# EAGLE design MAIN_MODULE (EAGLE 8.4.3)
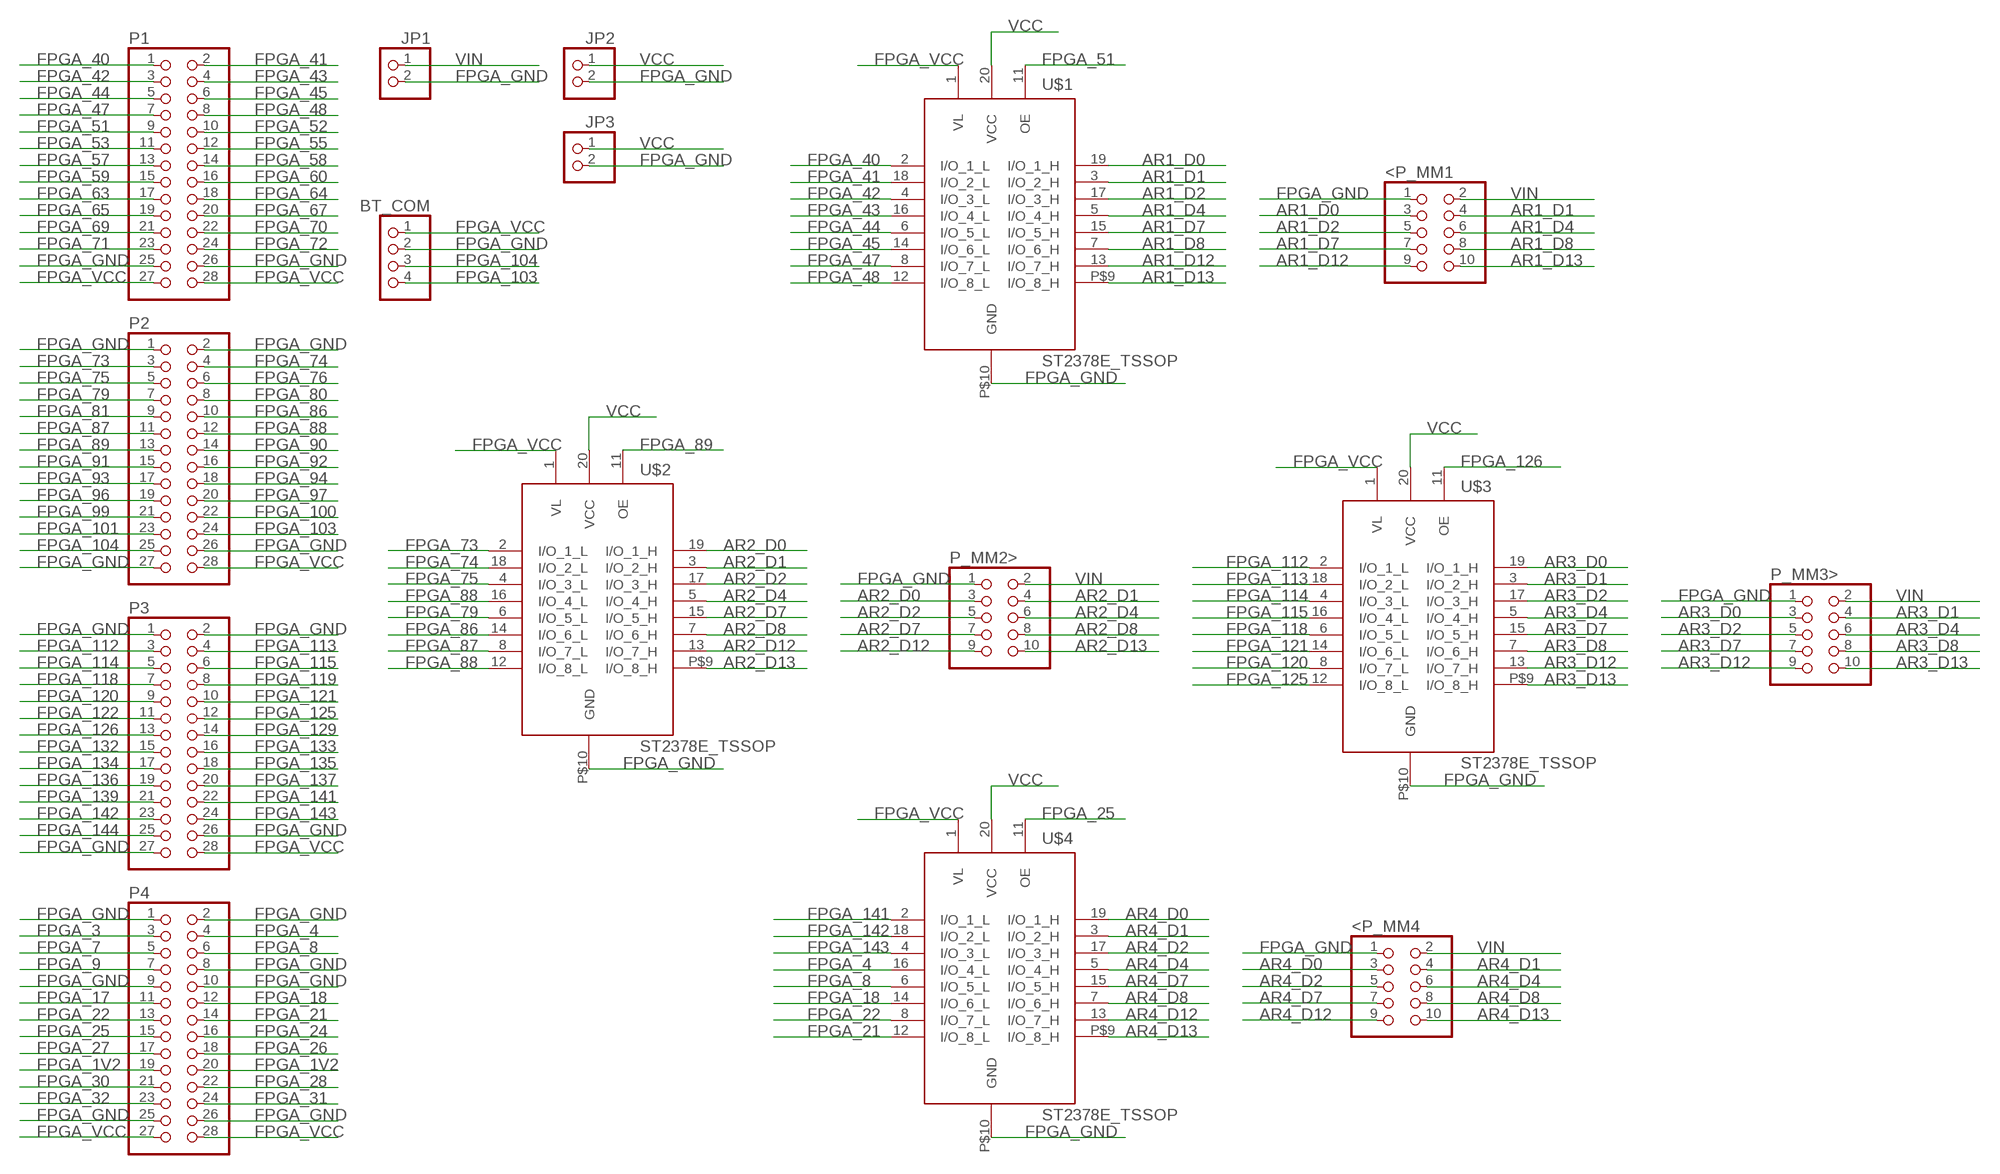
[diagram p0: schematic, sheet 1]

## Parts
<P_MM1  PINHD-2X5  [2X05]
<P_MM4  PINHD-2X5  [2X05]
BT_COM  PINHD-1X4  [1X04]
JP1  PINHD-1X2  [1X02]
JP2  PINHD-1X2  [1X02]
JP3  PINHD-1X2  [1X02]
P1  PINHD-2X14  [2X14]
P2  PINHD-2X14  [2X14]
P3  PINHD-2X14  [2X14]
P4  PINHD-2X14  [2X14]
P_MM2>  PINHD-2X5  [2X05]
P_MM3>  PINHD-2X5  [2X05]
U$1  ST2378E_TSSOP  [TSSOP20]
U$2  ST2378E_TSSOP  [TSSOP20]
U$3  ST2378E_TSSOP  [TSSOP20]
U$4  ST2378E_TSSOP  [TSSOP20]

## Nets
AR1_D0: <P_MM1.3 U$1.19(I/O_1_H)
AR1_D1: <P_MM1.4 U$1.3(I/O_2_H)
AR1_D2: <P_MM1.5 U$1.17(I/O_3_H)
AR1_D4: <P_MM1.6 U$1.5(I/O_4_H)
AR1_D7: <P_MM1.7 U$1.15(I/O_5_H)
AR1_D8: <P_MM1.8 U$1.7(I/O_6_H)
AR1_D12: <P_MM1.9 U$1.13(I/O_7_H)
AR1_D13: <P_MM1.10 U$1.P$9(I/O_8_H)
AR2_D0: P_MM2>.3 U$2.19(I/O_1_H)
AR2_D1: P_MM2>.4 U$2.3(I/O_2_H)
AR2_D2: P_MM2>.5 U$2.17(I/O_3_H)
AR2_D4: P_MM2>.6 U$2.5(I/O_4_H)
AR2_D7: P_MM2>.7 U$2.15(I/O_5_H)
AR2_D8: P_MM2>.8 U$2.7(I/O_6_H)
AR2_D12: P_MM2>.9 U$2.13(I/O_7_H)
AR2_D13: P_MM2>.10 U$2.P$9(I/O_8_H)
AR3_D0: P_MM3>.3 U$3.19(I/O_1_H)
AR3_D1: P_MM3>.4 U$3.3(I/O_2_H)
AR3_D2: P_MM3>.5 U$3.17(I/O_3_H)
AR3_D4: P_MM3>.6 U$3.5(I/O_4_H)
AR3_D7: P_MM3>.7 U$3.15(I/O_5_H)
AR3_D8: P_MM3>.8 U$3.7(I/O_6_H)
AR3_D12: P_MM3>.9 U$3.13(I/O_7_H)
AR3_D13: P_MM3>.10 U$3.P$9(I/O_8_H)
AR4_D0: <P_MM4.3 U$4.19(I/O_1_H)
AR4_D1: <P_MM4.4 U$4.3(I/O_2_H)
AR4_D2: <P_MM4.5 U$4.17(I/O_3_H)
AR4_D4: <P_MM4.6 U$4.5(I/O_4_H)
AR4_D7: <P_MM4.7 U$4.15(I/O_5_H)
AR4_D8: <P_MM4.8 U$4.7(I/O_6_H)
AR4_D12: <P_MM4.9 U$4.13(I/O_7_H)
AR4_D13: <P_MM4.10 U$4.P$9(I/O_8_H)
FPGA_1V2: P4.19 P4.20
FPGA_3: P4.3
FPGA_4: P4.4 U$4.16(I/O_4_L)
FPGA_7: P4.5
FPGA_8: P4.6 U$4.6(I/O_5_L)
FPGA_9: P4.7
FPGA_17: P4.11
FPGA_18: P4.12 U$4.14(I/O_6_L)
FPGA_21: P4.14 U$4.12(I/O_8_L)
FPGA_22: P4.13 U$4.8(I/O_7_L)
FPGA_24: P4.16
FPGA_25: P4.15 U$4.11(OE)
FPGA_26: P4.18
FPGA_27: P4.17
FPGA_28: P4.22
FPGA_30: P4.21
FPGA_31: P4.24
FPGA_32: P4.23
FPGA_40: P1.1 U$1.2(I/O_1_L)
FPGA_41: P1.2 U$1.18(I/O_2_L)
FPGA_42: P1.3 U$1.4(I/O_3_L)
FPGA_43: P1.4 U$1.16(I/O_4_L)
FPGA_44: P1.5 U$1.6(I/O_5_L)
FPGA_45: P1.6 U$1.14(I/O_6_L)
FPGA_47: P1.7 U$1.8(I/O_7_L)
FPGA_48: P1.8 U$1.12(I/O_8_L)
FPGA_51: P1.9 U$1.11(OE)
FPGA_52: P1.10
FPGA_53: P1.11
FPGA_55: P1.12
FPGA_57: P1.13
FPGA_58: P1.14
FPGA_59: P1.15
FPGA_60: P1.16
FPGA_63: P1.17
FPGA_64: P1.18
FPGA_65: P1.19
FPGA_67: P1.20
FPGA_69: P1.21
FPGA_70: P1.22
FPGA_71: P1.23
FPGA_72: P1.24
FPGA_73: P2.3 U$2.2(I/O_1_L)
FPGA_74: P2.4 U$2.18(I/O_2_L)
FPGA_75: P2.5 U$2.4(I/O_3_L)
FPGA_76: P2.6
FPGA_79: P2.7 U$2.6(I/O_5_L)
FPGA_80: P2.8
FPGA_81: P2.9
FPGA_86: P2.10 U$2.14(I/O_6_L)
FPGA_87: P2.11 U$2.8(I/O_7_L)
FPGA_88: P2.12 U$2.12(I/O_8_L) U$2.16(I/O_4_L)
FPGA_89: P2.13 U$2.11(OE)
FPGA_90: P2.14
FPGA_91: P2.15
FPGA_92: P2.16
FPGA_93: P2.17
FPGA_94: P2.18
FPGA_96: P2.19
FPGA_97: P2.20
FPGA_99: P2.21
FPGA_100: P2.22
FPGA_101: P2.23
FPGA_103: BT_COM.4 P2.24
FPGA_104: BT_COM.3 P2.25
FPGA_112: P3.3 U$3.2(I/O_1_L)
FPGA_113: P3.4 U$3.18(I/O_2_L)
FPGA_114: P3.5 U$3.4(I/O_3_L)
FPGA_115: P3.6 U$3.16(I/O_4_L)
FPGA_118: P3.7 U$3.6(I/O_5_L)
FPGA_119: P3.8
FPGA_120: P3.9 U$3.8(I/O_7_L)
FPGA_121: P3.10 U$3.14(I/O_6_L)
FPGA_122: P3.11
FPGA_125: P3.12 U$3.12(I/O_8_L)
FPGA_126: P3.13 U$3.11(OE)
FPGA_129: P3.14
FPGA_132: P3.15
FPGA_133: P3.16
FPGA_134: P3.17
FPGA_135: P3.18
FPGA_136: P3.19
FPGA_137: P3.20
FPGA_139: P3.21
FPGA_141: P3.22 U$4.2(I/O_1_L)
FPGA_142: P3.23 U$4.18(I/O_2_L)
FPGA_143: P3.24 U$4.4(I/O_3_L)
FPGA_144: P3.25
FPGA_GND: <P_MM1.1 <P_MM4.1 BT_COM.2 JP1.2 JP2.2 JP3.2 P1.25 P1.26 P2.1 P2.2 P2.26 P2.27 P3.1 P3.2 P3.26 P3.27 P4.1 P4.2 P4.8 P4.9 P4.10 P4.25 P4.26 P_MM2>.1 P_MM3>.1 U$1.P$10(GND) U$2.P$10(GND) U$3.P$10(GND) U$4.P$10(GND)
FPGA_VCC: BT_COM.1 P1.27 P1.28 P2.28 P3.28 P4.27 P4.28 U$1.1(VL) U$2.1(VL) U$3.1(VL) U$4.1(VL)
VCC: JP2.1 JP3.1 U$1.20(VCC) U$2.20(VCC) U$3.20(VCC) U$4.20(VCC)
VIN: <P_MM1.2 <P_MM4.2 JP1.1 P_MM2>.2 P_MM3>.2

## Library data of the parts
<P_MM1 <P_MM4 P_MM2> P_MM3> = pinhead:PINHD-2X5: PIN HEADER
BT_COM = pinhead:PINHD-1X4: PIN HEADER
JP1-JP3 = pinhead:PINHD-1X2: PIN HEADER
P1-P4 = pinhead:PINHD-2X14: PIN HEADER
U$1-U$4 = ST2378E:ST2378E_TSSOP

## Board
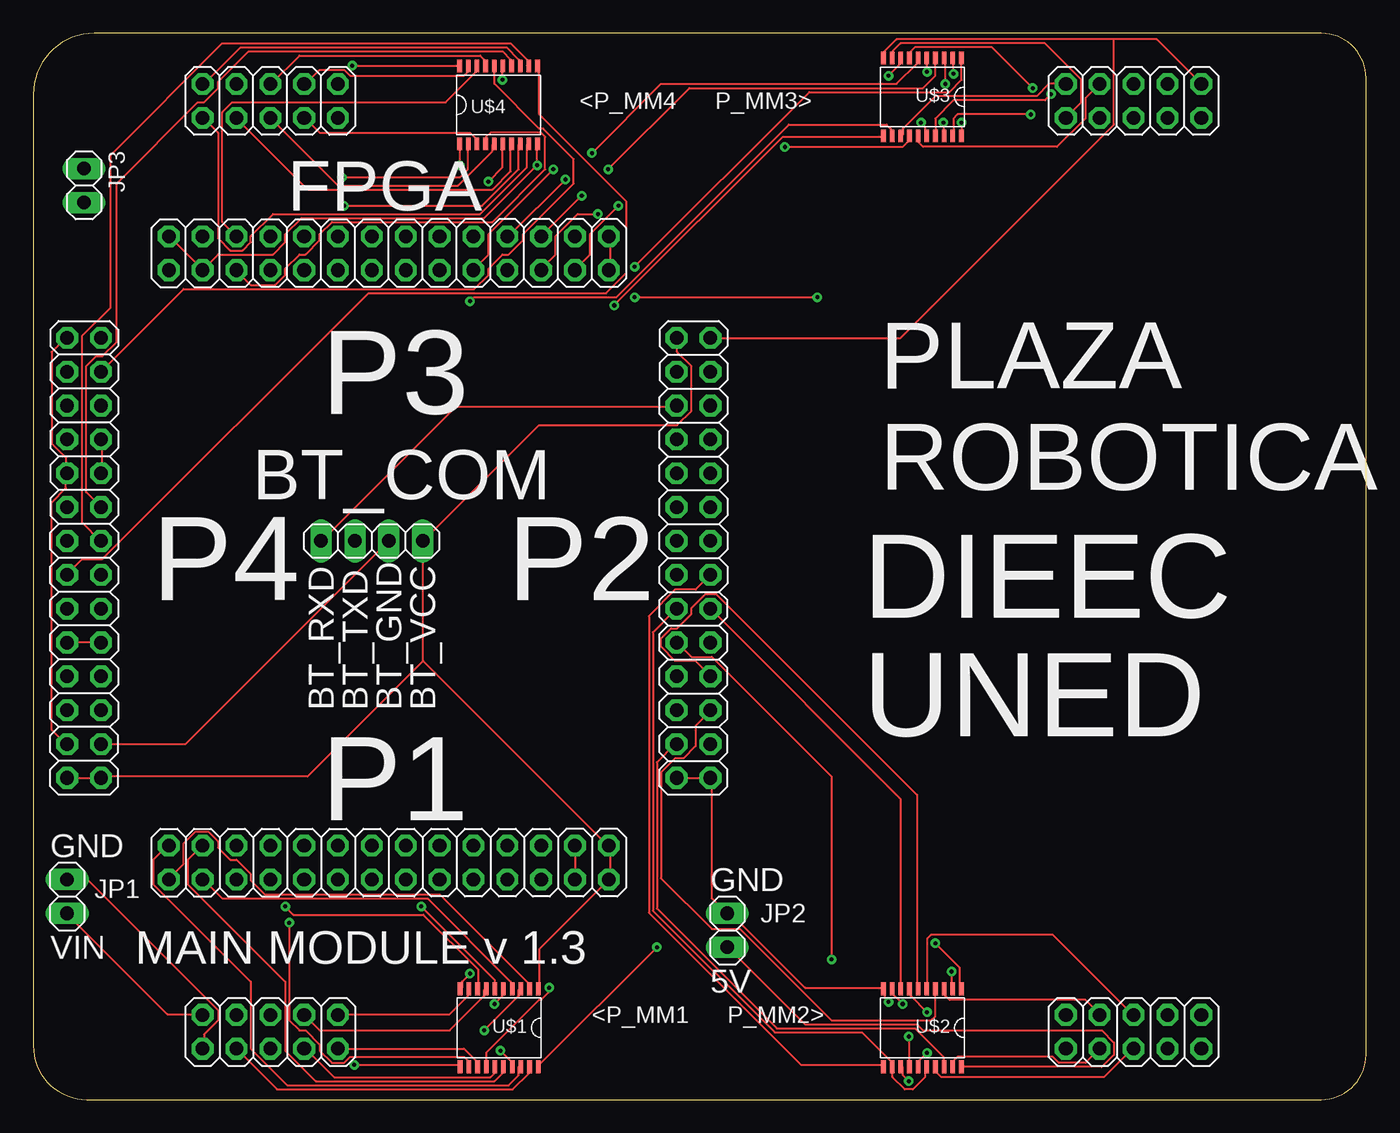
[diagram p1: board, top side]
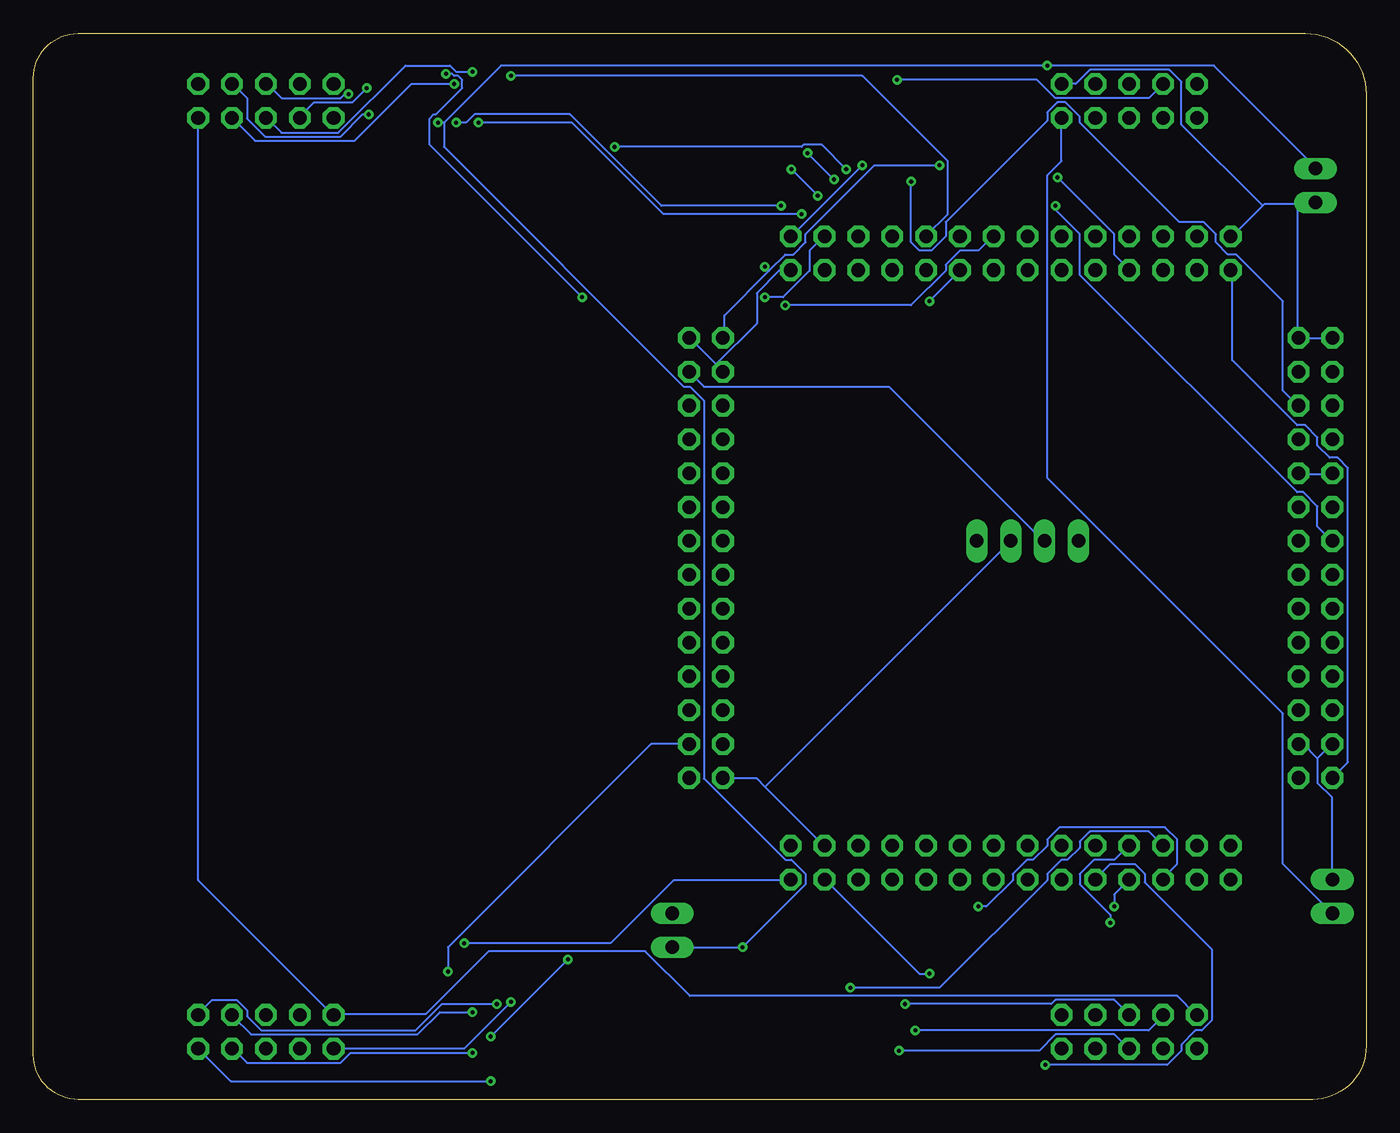
[diagram p2: board, bottom side, seen from below]

Size 100 x 80 mm. Coordinates in mm from the lower left corner, seen from the top.
Outline: 100,3.37 100,76.64 arc90 96.64,80 4.57,80 arc90 0,75.43 0,4.02 arc90 4.02,0 96.63,0 arc90 100,3.37
Copper layers (1*16): Top 0.035mm / dielectric 1.5mm / Bottom 0.035mm
Design rules "DFRobot_Eagle_Rule_v0.4": minimum track width 6mil, minimum drill 12mil, track to track 6mil, track to pad 6mil, pad to pad 6mil, via to via 6mil, smd to smd 0mil, copper to edge 10mil, drill to drill 10mil, minimum pad ring 12mil, minimum via ring 8mil, stop-mask expansion 2mil, vias tented up to drill 25mil, thermal gap 10mil

### Footprints (pad centres in the part's own frame; a part is rotated, then mirrored left to right if it is on the bottom)
2X05 = drill 1.016 octagon: 1 -5.08,-1.27; 2 -5.08,1.27; 3 -2.54,-1.27; 4 -2.54,1.27; 5 0,-1.27; 6 0,1.27; 7 2.54,-1.27; 8 2.54,1.27; 9 5.08,-1.27; 10 5.08,1.27
1X04 = drill 1.016 long: 1 -3.81,0; 2 -1.27,0; 3 1.27,0; 4 3.81,0
1X02 = drill 1.016 long: 1 -1.27,0; 2 1.27,0
2X14 = drill 1.016 octagon: 1 -16.51,-1.27; 2 -16.51,1.27; 3 -13.97,-1.27; 4 -13.97,1.27; 5 -11.43,-1.27; 6 -11.43,1.27; 7 -8.89,-1.27; 8 -8.89,1.27; 9 -6.35,-1.27; 10 -6.35,1.27; 11 -3.81,-1.27; 12 -3.81,1.27; 13 -1.27,-1.27; 14 -1.27,1.27; 15 1.27,-1.27; 16 1.27,1.27; 17 3.81,-1.27; 18 3.81,1.27; 19 6.35,-1.27; 20 6.35,1.27; 21 8.89,-1.27; 22 8.89,1.27; 23 11.43,-1.27; 24 11.43,1.27; 25 13.97,-1.27; 26 13.97,1.27; 27 16.51,-1.27; 28 16.51,1.27
TSSOP20 = smd 0.35 x 0.95: 1 -3.585,-3.225; 2 -2.935,-3.225; 3 -2.285,-3.225; 4 -1.635,-3.225; 5 -0.985,-3.225; 6 -0.335,-3.225; 7 0.315,-3.225; 8 0.965,-3.225; 11 2.265,2.625; 12 1.615,2.625; 13 0.965,2.625; 14 0.315,2.625; 15 -0.335,2.625; 16 -0.985,2.625; 17 -1.635,2.625; 18 -2.285,2.625; 19 -2.935,2.625; 20 -3.585,2.625; P$9 1.615,-3.225; P$10 2.265,-3.225

### Placement (x,y rotation side)
<P_MM1  17.78,5.08 0 top
<P_MM4  17.78,74.93 180 top
BT_COM  25.4,41.91 180 top
JP1  2.54,15.24 90 top
JP2  52.07,12.7 90 top
JP3  3.81,68.58 270 top
P1  26.67,17.78 0 top
P2  49.53,40.64 90 top
P3  26.67,63.5 180 top
P4  3.81,40.64 270 top
P_MM2>  82.55,5.08 0 top
P_MM3>  82.55,74.93 180 top
U$1  34.29,5.08 180 top
U$2  66.04,5.08 180 top
U$3  66.04,74.93 180 top
U$4  35.56,74.93 0 top

### Tracks (layer width: path | path; a pad name or v marks a point on that pad's centre or on a via)
AR1_D0
  Top 0.152: <P_MM1.3 18.29,0.76 35.97,0.76 37.19,1.98 37.19,2.44 U$1.19
AR1_D1  (via drill 0.3)
  Top 0.152: v33.83,5.18 36.42,7.77 36.42,8.23 U$1.3
  Bottom 0.152: v33.83,5.18 16.31,5.18 15.24,6.25 <P_MM1.4
AR1_D2  (via drill 0.3)
  Top 0.152: v35.05,3.66 35.81,2.9 35.81,2.59 U$1.17
  Bottom 0.152: v35.05,3.66 24.54,3.66 23.32,4.88 18.9,4.88 17.83,3.81 <P_MM1.5
AR1_D4  (via drill 0.3)
  Top 0.152: v34.59,7.16 35.2,7.77 35.2,8.23 U$1.5
  Bottom 0.152: v34.59,7.16 23.62,7.16 23.32,7.47 18.9,7.47 <P_MM1.6
AR1_D7
  Top 0.152: U$1.15 34.59,2.44 34.59,1.98 34.29,1.68 22.55,1.68 20.42,3.81 <P_MM1.7
AR1_D8
  Top 0.152: <P_MM1.8 21.49,5.18 31.24,5.18 33.83,7.77 33.83,8.23 U$1.7
AR1_D12
  Top 0.152: <P_MM1.9 32.31,3.81 33.22,2.9 33.22,2.59 U$1.13
AR1_D13
  Top 0.152: U$1.P$9 32.61,8.23 32.61,7.77 31.24,6.4 22.86,6.4 <P_MM1.10
AR2_D0
  Top 0.152: P_MM2>.3 78.94,2.74 76.96,2.74 76.5,3.2 69.34,3.2 69.04,2.9 69.04,2.59 U$2.19
AR2_D1
  Top 0.152: U$2.3 68.43,8.23 68.43,7.77 68.73,7.47 78.94,7.47 80.01,6.4 P_MM2>.4
AR2_D2
  Top 0.152: U$2.17 67.82,2.44 67.82,1.98 68.12,1.68 80.31,1.68 82.45,3.81 P_MM2>.5
AR2_D4
  Top 0.152: U$2.5 67.06,8.38 67.06,12.04 67.36,12.34 76.5,12.34 82.45,6.4 P_MM2>.6
AR2_D7  (via drill 0.3)
  Top 0.152: v67.06,3.5 66.45,2.9 66.45,2.59 U$2.15
  Bottom 0.152: v67.06,3.5 76.2,3.5 76.96,2.74 83.97,2.74 85.04,3.81 P_MM2>.7
AR2_D8  (via drill 0.3)
  Top 0.152: v67.06,6.55 65.84,7.77 65.84,8.23 U$2.7
  Bottom 0.152: v67.06,6.55 69.49,6.55 71.17,4.88 83.67,4.88 85.04,6.25 P_MM2>.8
AR2_D12  (via drill 0.3)
  Top 0.152: v65.68,1.37 65.23,1.83 65.23,2.44 U$2.13
  Bottom 0.152: v65.68,1.37 85.19,1.37 P_MM2>.9
AR2_D13  (via drill 0.3)
  Top 0.152: v65.23,7.16 64.47,7.92 64.47,8.23 U$2.P$9
  Bottom 0.152: v65.23,7.16 69.34,7.16 71.32,5.18 82.91,5.18 83.97,6.25 83.97,6.71 84.73,7.47 86.56,7.47 87.63,6.4 P_MM2>.10
AR3_D0  (via drill 0.3)
  Top 0.152: v74.83,73.91 69.34,73.91 69.04,73.61 69.04,72.39 U$3.19
  Bottom 0.152: v74.83,73.91 75.29,73.91 76.96,72.24 82.6,72.24 83.97,73.61 83.97,75.13 85.04,76.2 P_MM3>.3
AR3_D1  (via drill 0.3)
  Top 0.152: v68.43,76.2 68.43,78.03 U$3.3
  Bottom 0.152: v68.43,76.2 71.63,76.2 75.89,71.93 83.36,71.93 P_MM3>.4
AR3_D2  (via drill 0.3)
  Top 0.152: v76.35,75.44 75.89,74.98 69.04,74.98 67.67,73.61 67.67,72.39 U$3.17
  Bottom 0.152: v76.35,75.44 76.66,75.44 76.96,75.13 81.38,75.13 82.45,76.2 P_MM3>.5
AR3_D4  (via drill 0.3)
  Top 0.152: v67.06,77.11 67.06,78.03 U$3.5
  Bottom 0.152: v67.06,77.11 68.28,77.11 68.73,77.57 72.08,77.57 77.11,72.54 81.38,72.54 82.45,73.61 P_MM3>.6
AR3_D7
  Top 0.152: P_MM3>.7 78.94,75.13 78.94,73.61 76.81,71.48 66.75,71.48 66.45,71.78 66.45,72.24 U$3.15
AR3_D8  (via drill 0.3)
  Top 0.152: v74.98,75.89 71.93,78.94 66.14,78.94 65.84,78.64 65.84,78.18 U$3.7
  Bottom 0.152: v74.98,75.89 76.05,74.83 78.94,74.83 80.01,73.76 P_MM3>.8
AR3_D12
  Top 0.152: P_MM3>.9 76.2,76.2 75.29,75.29 67.67,75.29 65.23,72.85 65.23,72.39 U$3.13
AR3_D13
  Top 0.152: P_MM3>.10 78.64,74.83 78.64,76.5 75.89,79.25 65.08,79.25 64.47,78.64 64.47,78.18 U$3.P$9
AR4_D0
  Top 0.152: U$4.19 32.61,77.42 32.61,77.11 32.31,76.81 23.77,76.81 23.32,77.27 21.49,77.27 20.42,76.2 <P_MM4.3
AR4_D1
  Top 0.152: U$4.3 33.22,71.78 33.22,72.08 32.77,72.54 21.49,72.54 20.42,73.61 <P_MM4.4
AR4_D2
  Top 0.152: U$4.17 33.83,77.57 33.83,78.03 33.53,78.33 19.96,78.33 17.83,76.2 <P_MM4.5
AR4_D4
  Top 0.152: <P_MM4.6 22.86,68.58 31.85,68.58 34.44,71.17 34.44,71.63 U$4.5
AR4_D7  (via drill 0.3)
  Top 0.152: v35.2,76.5 35.2,77.42 U$4.15
  Bottom 0.152: v35.2,76.5 24.69,76.5 23.32,75.13 16.31,75.13 <P_MM4.7
AR4_D8
  Top 0.152: U$4.7 35.81,71.63 35.81,69.65 34.44,68.28 20.57,68.28 15.24,73.61 <P_MM4.8
AR4_D12
  Top 0.152: U$4.13 36.42,77.57 36.42,78.03 35.51,78.94 15.54,78.94 12.8,76.2 <P_MM4.9
AR4_D13
  Top 0.152: U$4.P$9 37.03,71.63 37.03,69.95 33.53,66.45 17.98,66.45 16.31,64.77 16.31,64.31 15.7,63.7 14.78,63.7 13.87,64.62 13.87,72.54 12.8,73.61 <P_MM4.10
FPGA_1V2
  Top 0.152: P4.20 P4.19
FPGA_4
  Top 0.152: P4.4 11.28,60.81 33.07,60.81 34.14,61.87 34.14,62.33 35.2,63.4 35.66,63.4 36.73,64.47 36.73,64.92 40.54,68.73 40.54,70.56 38.25,72.85 37.95,72.85 34.59,76.2 34.59,77.42 U$4.16
FPGA_8  (via drill 0.3)
  Top 0.152: v34.14,68.89 35.2,69.95 35.2,71.63 U$4.6
  Bottom 0.152: v34.14,68.89 34.14,64.31 33.53,63.7 32.61,63.7 31.55,64.77 31.55,65.84 23.93,73.46 23.93,74.07 23.16,74.83 22.55,74.83 21.49,73.76 21.49,73.3 14.02,65.84 12.19,65.84 11.28,64.92 11.28,64.31 10.36,63.4 9.75,63.4 6.25,59.89 6.25,53.19 5.18,52.12 P4.6
FPGA_18
  Top 0.152: P4.12 3.96,45.57 3.96,55.02 4.72,55.78 5.18,55.78 6.25,56.84 6.25,68.73 12.34,74.83 12.8,74.83 13.87,75.89 13.87,76.35 16.15,78.64 35.2,78.64 35.81,78.03 35.81,77.57 U$4.14
FPGA_21
  Top 0.152: U$4.12 37.03,77.57 37.03,78.03 35.81,79.25 14.17,79.25 5.79,70.87 5.79,59.44 3.66,57.3 3.66,43.28 5.03,41.91 P4.14
FPGA_22  (via drill 0.3)
  Top 0.152: v23.32,67.06 33.68,67.06 36.42,69.8 36.42,71.63 U$4.8
  Bottom 0.152: v23.32,67.06 23.32,66.75 21.49,64.92 21.49,61.87 5.18,45.57 4.72,45.57 3.66,44.5 3.66,42.98 2.59,41.91 P4.13
FPGA_25
  Top 0.152: U$4.11 37.95,77.42 37.95,73.91 44.5,67.36 44.5,62.03 42.98,60.5 25.15,60.5 5.18,40.54 3.66,40.54 2.59,39.47 P4.15
FPGA_40
  Top 0.152: U$1.2 37.19,8.38 37.19,8.69 30.48,15.39 17.37,15.39 16.31,16.46 16.31,16.92 15.24,17.98 14.78,17.98 13.87,18.9 13.87,19.36 13.11,20.12 12.19,20.12 11.28,19.2 11.28,17.68 10.21,16.61 P1.1
FPGA_41
  Top 0.152: U$1.18 36.42,2.44 36.42,1.83 35.66,1.07 19.05,1.07 16.31,3.81 16.31,8.84 8.99,16.15 8.99,17.98 10.06,19.05 P1.2
FPGA_42
  Top 0.152: U$1.4 35.81,8.38 35.81,8.84 29.57,15.09 14.17,15.09 12.8,16.46 P1.3
FPGA_43
  Top 0.152: U$1.16 35.2,2.44 35.2,1.98 34.59,1.37 21.18,1.37 18.9,3.66 18.9,8.84 11.58,16.15 11.58,17.98 12.65,19.05 P1.4
FPGA_44  (via drill 0.3)
  Top 0.152: v29.11,14.48 34.59,8.99 34.59,8.38 U$1.6
  Bottom 0.152: v29.11,14.48 28.5,14.48 26.52,16.46 26.52,16.92 25.45,17.98 24.99,17.98 23.93,19.05 23.93,19.51 23.01,20.42 15.09,20.42 14.17,19.51 14.17,17.68 15.24,16.61 P1.5
FPGA_45  (via drill 0.3)
  Top 0.152: v38.71,8.38 38.71,8.08 38.1,7.47 37.95,7.47 33.98,3.5 33.98,2.59 U$1.14
  Bottom 0.152: v38.71,8.38 32,8.38 23.93,16.46 23.93,16.92 22.86,17.98 22.4,17.98 21.49,18.9 21.49,19.36 20.73,20.12 16.31,20.12 P1.6
FPGA_47  (via drill 0.3)
  Top 0.152: v18.9,14.48 19.51,13.87 29.26,13.87 33.38,9.75 33.38,8.38 U$1.8
  Bottom 0.152: v18.9,14.48 18.9,15.39 P1.7
FPGA_48  (via drill 0.3)
  Top 0.152: v19.2,13.26 19.2,5.94 19.96,5.18 20.42,5.18 21.49,4.12 21.49,3.66 22.4,2.74 23.32,2.74 23.77,3.2 32.31,3.2 32.61,2.9 32.61,2.59 U$1.12
  Bottom 0.152: v19.2,13.26 19.2,13.87 21.49,16.15 21.49,16.92 20.42,17.98 18.9,17.98 17.83,19.05 P1.8
FPGA_51  (via drill 0.3)
  Top 0.152: v24.08,2.59 32,2.59 U$1.11
  Bottom 0.152: v24.08,2.59 14.94,2.59 13.87,3.66 13.87,4.12 12.8,5.18 12.34,5.18 11.58,5.94 11.58,11.28 16.61,16.31 16.61,16.92 17.37,17.68 19.2,17.68 20.27,16.61 P1.9
FPGA_73  (via drill 0.3)
  Top 0.152: v68.89,9.6 68.89,8.38 U$2.2
  Bottom 0.152: v68.89,9.6 68.89,11.43 53.65,26.67 P2.3
FPGA_74
  Top 0.152: U$2.18 68.28,2.59 68.28,3.2 66.14,5.33 55.78,5.33 46.79,14.33 46.79,25.3 48.16,26.67 P2.4
FPGA_75
  Top 0.152: U$2.4 67.67,8.23 67.67,6.25 67.36,5.94 59.89,5.94 53.03,12.8 50.9,12.8 47.09,16.61 47.09,24.54 48.16,25.6 48.77,25.6 49.68,26.52 49.68,28.04 50.75,29.11 P2.5
FPGA_79
  Top 0.152: U$2.6 66.29,8.38 66.29,22.86 51.21,37.95 50.44,37.95 49.38,36.88 49.38,36.42 48.31,35.36 47.85,35.36 47.09,34.59 47.09,33.98 48.16,32.92 49.68,32.92 50.75,31.85 P2.7
FPGA_86  (via drill 0.3)
  Top 0.152: v65.68,4.72 65.68,2.59 U$2.14 | v59.89,10.52 59.89,24.23 50.9,33.22 49.38,33.22 48.31,34.29 P2.10
  Bottom 0.152: v59.89,10.52 v65.68,4.72
FPGA_87
  Top 0.152: P2.11 65.08,22.55 65.08,8.38 U$2.8
FPGA_88
  Top 0.152: U$2.16 66.9,2.44 66.9,1.68 65.99,0.76 65.38,0.76 64.47,1.68 64.47,2.44 U$2.12 64.31,2.59 64.31,2.9 62.18,5.03 55.63,5.03 46.48,14.17 46.48,35.05 P2.12
FPGA_89
  Top 0.152: P2.13 49.68,38.25 48.16,38.25 46.18,36.27 46.18,14.02 57.61,2.59 63.7,2.59 U$2.11
FPGA_103
  Top 0.152: BT_COM.4 21.64,41.91 31.7,51.97 48.16,51.97 P2.24
FPGA_104
  Bottom 0.152: P2.25 49.68,53.49 35.81,53.49 24.23,41.91 BT_COM.3
FPGA_112  (via drill 0.3)
  Top 0.152: v69.04,76.96 69.04,78.03 U$3.2 | v45.11,60.2 v58.83,60.2
  Bottom 0.152: v69.04,76.96 68.58,76.96 68.43,76.81 68.12,76.81 67.82,76.5 67.82,75.89 69.8,73.91 69.95,73.91 70.26,73.61 70.26,71.63 v58.83,60.2 | v45.11,60.2 43.74,60.2 41.76,62.18 41.76,63.7 40.69,64.77 P3.3
FPGA_113  (via drill 0.3)
  Top 0.152: v68.28,73.3 68.28,72.39 U$3.18 | v43.89,67.06 41.76,64.92 41.76,63.4 40.69,62.33 P3.4
  Bottom 0.152: v68.28,73.3 67.51,73.3 66.9,73.91 59.74,73.91 52.88,67.06 v43.89,67.06
FPGA_114  (via drill 0.3)
  Top 0.152: v43.13,69.8 49.23,75.89 66.75,75.89 67.67,76.81 67.67,78.03 U$3.4 | P3.5 v41.15,67.82
  Bottom 0.152: v41.15,67.82 v43.13,69.8
FPGA_115  (via drill 0.3)
  Top 0.152: v66.6,73.3 66.9,73 66.9,72.39 U$3.16 | v42.37,66.45 40.84,66.45 39.17,64.77 39.17,63.4 38.1,62.33 P3.6
  Bottom 0.152: v66.6,73.3 59.59,73.3 52.73,66.45 v42.37,66.45
FPGA_118  (via drill 0.3)
  Top 0.152: v41.91,71.02 47.09,76.2 64.77,76.2 66.29,77.72 66.29,78.03 U$3.6 | v39.93,69.04 35.66,64.77 P3.7
  Bottom 0.152: v39.93,69.04 v41.91,71.02
FPGA_120  (via drill 0.3)
  Top 0.152: v64.16,76.81 65.08,77.72 65.08,78.03 U$3.8
  Bottom 0.152: v64.16,76.81 37.8,76.81 31.39,70.41 31.39,66.45 33.07,64.77 P3.9
FPGA_121  (via drill 0.3)
  Top 0.152: v56.39,71.48 65.23,71.48 65.68,71.93 65.68,72.24 U$3.14 | v39.01,69.8 34.14,64.92 34.14,63.4 33.07,62.33 P3.10
  Bottom 0.152: v56.39,71.48 42.37,71.48 42.22,71.63 40.84,71.63 v39.01,69.8
FPGA_125  (via drill 0.3)
  Top 0.152: v32.77,59.89 33.07,60.2 43.74,60.2 56.69,73.15 64.01,73.15 64.31,72.85 64.31,72.39 U$3.12
  Bottom 0.152: v32.77,59.89 30.48,62.18 P3.12
FPGA_126  (via drill 0.3)
  Top 0.152: v43.59,59.59 56.24,72.24 63.7,72.24 U$3.11
  Bottom 0.152: v43.59,59.59 34.14,59.59 31.55,62.18 31.55,62.64 30.48,63.7 29.11,63.7 28.04,64.77 P3.13
FPGA_141  (via drill 0.3)
  Top 0.152: v23.16,69.19 32,69.19 32.61,69.8 32.61,71.63 U$4.2
  Bottom 0.152: v23.16,69.19 18.9,64.92 18.9,63.4 17.83,62.33 P3.22
FPGA_142
  Top 0.152: P3.23 14.17,65.84 14.17,74.07 14.94,74.83 30.94,74.83 33.22,77.11 33.22,77.42 U$4.18
FPGA_143
  Top 0.152: U$4.4 33.98,71.78 33.98,72.24 34.29,72.54 38.1,72.54 38.41,72.24 38.41,69.8 34.44,65.84 22.4,65.84 21.49,64.92 21.49,64.47 20.42,63.4 19.96,63.4 18.9,62.33 18.9,61.87 18.14,61.11 16.31,61.11 15.24,62.18 P3.24
FPGA_GND  (via drill 0.3)
  Top 0.152: 81.08,79.55 84.28,79.55 P_MM3>.1 | 81.08,79.55 64.77,79.55 63.86,78.64 63.86,78.18 U$3.P$10 | U$4.P$10 37.8,71.63 v37.8,70.1 33.83,66.14 20.12,66.14 18.9,64.92 18.9,64.31 17.98,63.4 13.87,63.4 P3.26 12.65,62.33 10.21,64.77 P3.27 | P3.2 43.28,62.33 43.28,64.77 P3.1 | 81.08,79.55 81.08,73.15 65.08,57.15 P2.27 | P2.2 48.31,24.08 50.75,24.08 P2.1 50.9,24.08 50.9,15.09 51.97,14.02 JP2.2 52.12,13.87 52.43,13.87 57.91,8.38 63.7,8.38 U$2.P$10 63.86,8.23 63.86,7.62 v64.16,7.32 | v32.77,9.45 32.16,8.84 32.16,8.38 U$1.P$10 | P1.26 40.69,19.05 40.69,16.61 P1.25 | P4.8 5.18,49.53 5.18,47.09 P4.10 | P4.1 2.44,57.15 1.37,56.08 1.37,49.23 2.44,48.16 2.44,47.09 P4.9 2.44,46.94 2.44,45.87 1.37,44.81 1.37,27.74 2.44,26.67 P4.25 | <P_MM1.1 12.8,3.81 12.8,4.88 13.87,5.94 13.87,6.71 4.12,16.46 2.59,16.46 JP1.2 | BT_COM.2 11.43,26.67 P4.26
  Bottom 0.152: 48.77,55.17 50.75,57.15 P2.27 | 48.77,55.17 48.31,54.71 P2.26 48.77,55.17 | v37.8,70.1 43.13,64.77 P3.1 | 48.77,55.17 45.72,58.22 45.72,60.5 44.04,62.18 43.28,62.18 P3.2 | v32.77,9.45 33.53,9.45 40.54,16.46 P1.25 | 45.11,23.47 40.69,19.05 P1.26 | 45.11,23.47 45.72,24.08 48.16,24.08 P2.2 | P_MM2>.1 67.67,3.81 v64.16,7.32 | P4.9 2.59,46.94 5.03,46.94 P4.10 | P4.1 P4.2 5.18,57.15 5.18,67.21 | 5.18,67.21 7.62,67.21 7.77,67.06 | 5.18,67.21 3.81,67.21 JP3.2 5.18,67.21 | 7.77,67.06 10.06,64.77 P3.27 | <P_MM4.1 21.79,76.2 20.73,77.27 14.78,77.27 13.87,76.35 13.87,73.15 7.77,67.06 | 3.66,25.6 3.66,23.77 2.59,22.71 2.59,16.61 JP1.2 | 3.66,25.6 2.59,26.67 P4.25 | P4.26 4.72,26.67 3.66,25.6 | BT_COM.2 45.11,23.47
FPGA_VCC  (via drill 0.3)
  Top 0.152: v32,70.1 32,71.63 U$4.1 | v45.11,62.48 58.22,75.59 68.73,75.59 69.65,76.5 69.65,78.03 U$3.1 | P4.27 2.59,24.08 5.03,24.08 P4.28 5.18,24.23 20.57,24.23 29.26,32.92 | U$1.1 37.95,8.38 37.95,11.28 P1.27 43.28,16.61 43.28,19.05 P1.28 43.13,19.05 29.26,32.92 | v67.67,11.73 69.49,9.91 69.49,8.38 U$2.1 | 29.26,32.92 29.26,41.91 | 29.26,41.91 37.95,50.6 48.31,50.6 49.38,51.66 49.38,55.02 48.31,56.08 48.31,57.15 P2.28 | 29.26,41.91 BT_COM.1
  Bottom 0.152: v32,70.1 36.88,70.1 42.06,64.92 42.06,64.31 42.98,63.4 43.59,63.4 44.81,62.18 | 44.81,62.18 48.16,58.83 48.16,57.15 P2.28 | 44.81,62.18 v45.11,62.48 | P4.27 1.37,25.3 1.37,47.4 2.13,48.16 2.74,48.16 3.66,49.07 3.66,49.68 4.57,50.6 5.18,50.6 10.06,55.47 10.06,62.18 P3.28 | v67.67,11.73 56.69,11.73 51.97,16.46 43.28,16.46 P1.27
VCC  (via drill 0.3)
  Top 0.152: v46.79,11.43 37.95,2.59 U$1.20 | U$2.20 69.65,2.44 80.16,2.44 81.08,3.35 81.08,4.27 80.16,5.18 66.75,5.18 66.29,5.64 57.91,5.64 52.12,11.43 JP2.1 | v23.93,77.57 31.85,77.57 U$4.20 | v69.65,73.3 69.65,72.39 U$3.20
  Bottom 0.152: JP2.1 v46.79,11.43 42.06,16.15 42.06,16.92 43.13,17.98 43.59,17.98 49.68,24.08 49.68,52.43 50.75,53.49 51.21,53.49 69.19,71.48 69.19,73.3 | JP3.1 3.81,69.95 11.43,77.57 v23.93,77.57 64.92,77.57 69.19,73.3 | 69.19,73.3 v69.65,73.3
VIN
  Top 0.152: <P_MM1.2 12.65,6.4 10.06,6.4 2.59,13.87 JP1.1
  Bottom 0.152: <P_MM4.2 22.86,70.41 23.93,69.34 23.93,46.63 6.25,28.96 6.25,17.68 JP1.1 | <P_MM1.2 12.8,6.4 14.17,7.77 50.75,7.77 54.1,11.12 65.84,11.12 70.56,6.4 77.42,6.4 P_MM2>.2 77.57,6.4 87.63,16.46 P_MM3>.2

### Text on the board
tNames: FPGA | PLAZA / ROBOTICA | DIEEC | UNED | BT_RXD | BT_TXD | BT_GND | BT_VCC | GND | GND | VIN | MAIN MODULE v 1.3 | 5V